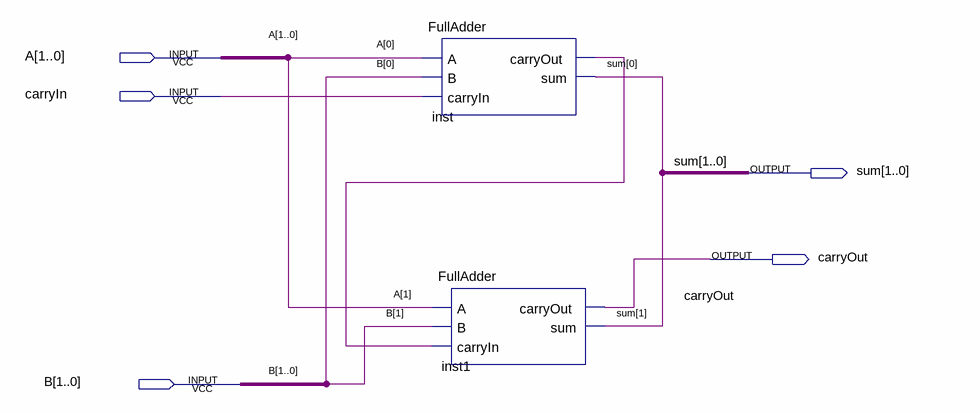
[diagram p0: schematic sheet]
// Quartus schematic CarryRipple2.bdf as structural Verilog: 2 symbols, 5 pins
module CarryRipple2 (
  input  [1:0] A,
  input  carryIn,
  input  [1:0] B,
  output [1:0] sum,
  output carryOut
);

  wire inst_carryout;

  FullAdder inst (.A(A[0]), .B(B[0]), .carryIn(carryIn), .carryOut(inst_carryout), .sum(sum[0]));
  FullAdder inst1 (.A(A[1]), .B(B[1]), .carryIn(inst_carryout), .carryOut(carryOut), .sum(sum[1]));
endmodule
